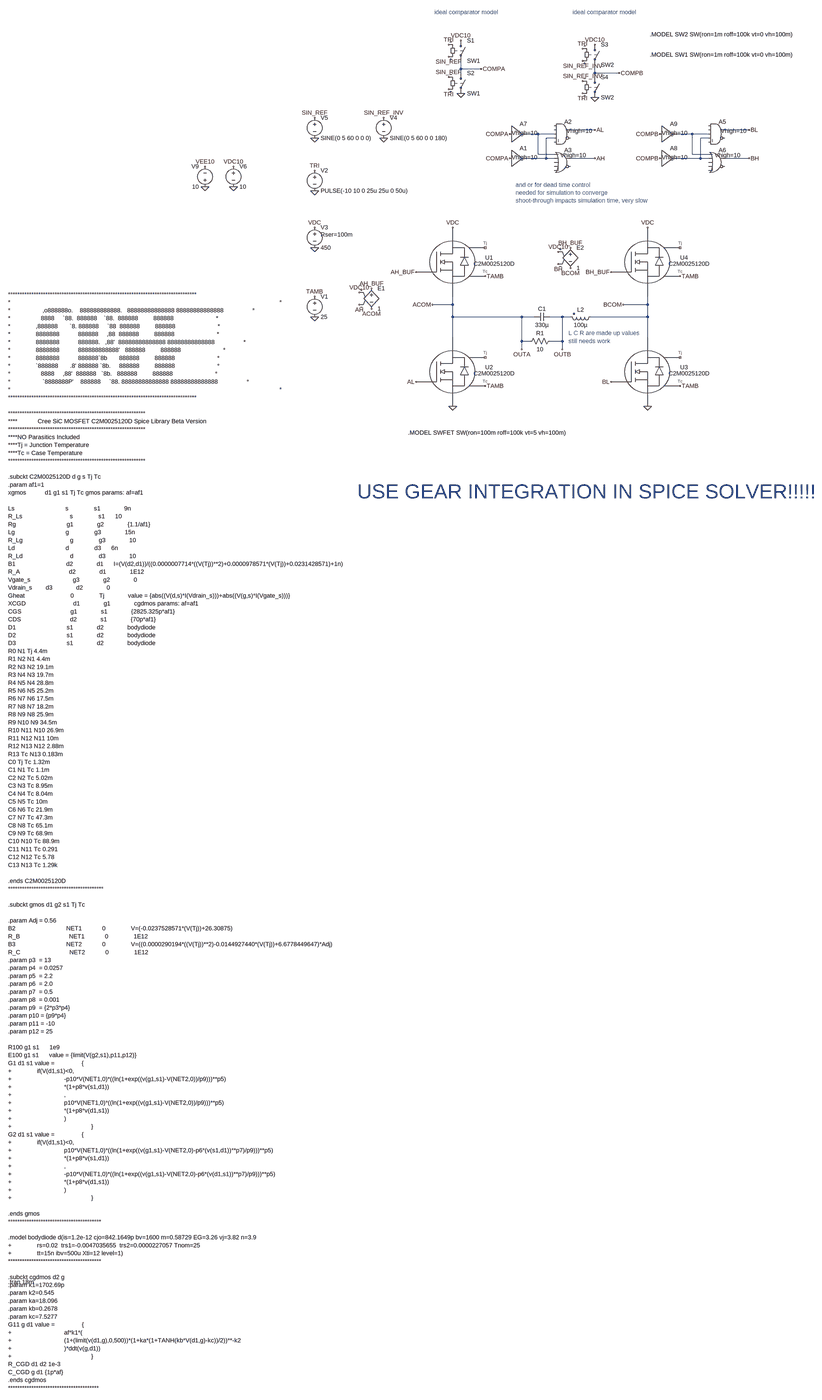
[diagram p0: schematic littlebox.asc, whole sheet]
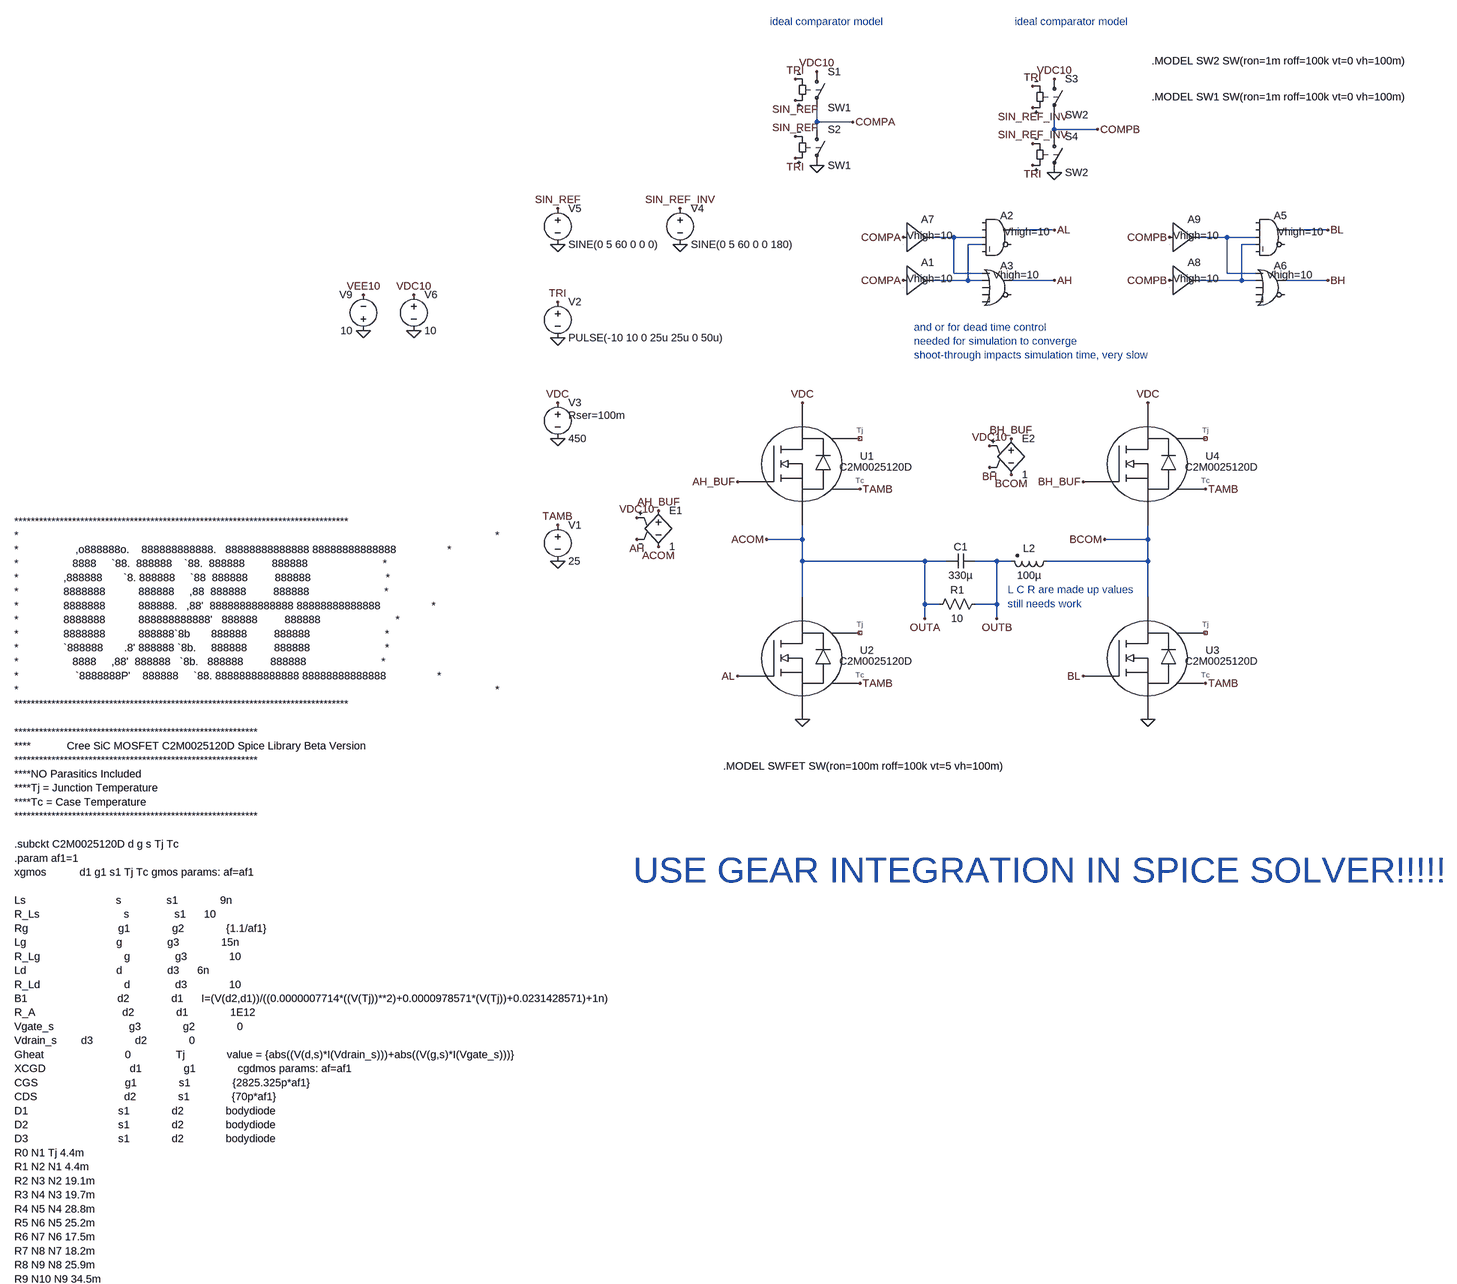
[diagram p1: schematic littlebox.asc, part, row 1 of 2, column 1 of 1]
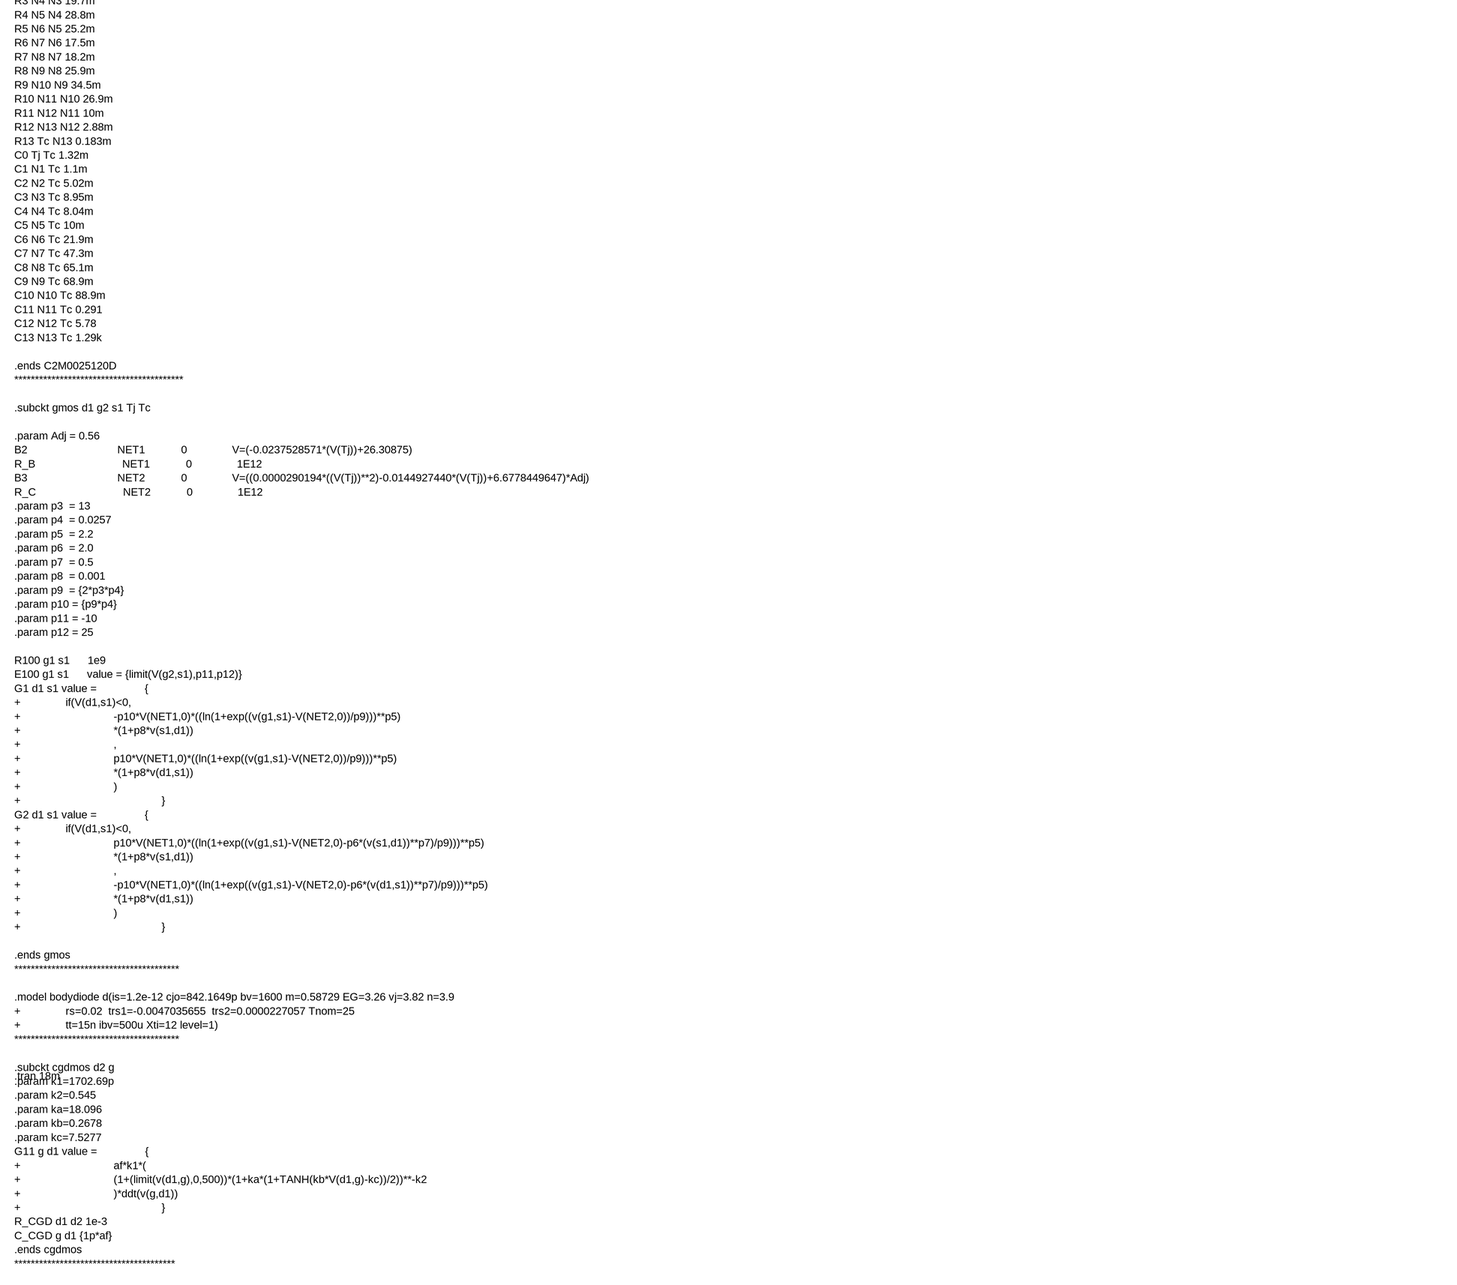
[diagram p2: schematic littlebox.asc, part, row 2 of 2, column 1 of 1]
littlebox.asc, the LTspice schematic file:
Version 4
SHEET 1 1896 3592
WIRE 224 -1200 224 -1232
WIRE 304 -1200 224 -1200
WIRE 224 -1184 224 -1200
WIRE 752 -1184 752 -1216
WIRE 848 -1184 752 -1184
WIRE 752 -1168 752 -1184
WIRE 752 -960 656 -960
WIRE 1360 -960 1264 -960
WIRE 528 -944 480 -944
WIRE 592 -944 528 -944
WIRE 1136 -944 1072 -944
WIRE 1200 -944 1136 -944
WIRE 592 -928 560 -928
WIRE 1200 -928 1168 -928
WIRE 528 -864 528 -944
WIRE 592 -864 528 -864
WIRE 1136 -864 1136 -944
WIRE 1200 -864 1136 -864
WIRE 560 -848 560 -928
WIRE 560 -848 480 -848
WIRE 592 -848 560 -848
WIRE 752 -848 656 -848
WIRE 1168 -848 1168 -928
WIRE 1168 -848 1072 -848
WIRE 1200 -848 1168 -848
WIRE 1360 -848 1264 -848
WIRE 192 -272 192 -304
WIRE 192 -272 112 -272
WIRE 960 -272 960 -304
WIRE 960 -272 864 -272
WIRE 192 -224 192 -272
WIRE 464 -224 192 -224
WIRE 512 -224 464 -224
WIRE 624 -224 576 -224
WIRE 656 -224 624 -224
WIRE 960 -224 960 -272
WIRE 960 -224 736 -224
WIRE 192 -144 192 -224
WIRE 960 -144 960 -224
WIRE 464 -128 464 -224
WIRE 496 -128 464 -128
WIRE 624 -128 624 -224
WIRE 624 -128 576 -128
WIRE 464 -96 464 -128
WIRE 624 -96 624 -128
FLAG -352 -720 0
FLAG -352 -224 0
FLAG -352 -496 0
FLAG 320 -384 TAMB
FLAG 320 48 TAMB
FLAG 1088 -384 TAMB
FLAG 1088 48 TAMB
FLAG 192 128 0
FLAG 960 128 0
FLAG 192 -576 VDC
FLAG 960 -576 VDC
FLAG -352 -576 VDC
FLAG 48 -400 AH_BUF
FLAG 48 32 AL
FLAG 816 -400 BH_BUF
FLAG 816 32 BL
FLAG -352 -304 TAMB
FLAG -352 -928 0
FLAG -80 -928 0
FLAG -80 -1008 SIN_REF_INV
FLAG -352 -1008 SIN_REF
FLAG -352 -800 TRI
FLAG -672 -736 0
FLAG -672 -816 VDC10
FLAG 176 -1248 SIN_REF
FLAG 176 -1296 TRI
FLAG 112 -272 ACOM
FLAG 864 -272 BCOM
FLAG 224 -1312 VDC10
FLAG 752 -1296 VDC10
FLAG -784 -816 VEE10
FLAG -784 -736 0
FLAG 304 -1200 COMPA
FLAG 848 -1184 COMPB
FLAG 224 -1104 0
FLAG 752 -1088 0
FLAG 176 -1120 TRI
FLAG 176 -1168 SIN_REF
FLAG 704 -1104 TRI
FLAG 704 -1152 SIN_REF_INV
FLAG 704 -1280 TRI
FLAG 704 -1232 SIN_REF_INV
FLAG 416 -848 COMPA
FLAG 416 -944 COMPA
FLAG 752 -960 AL
FLAG -176 -320 VDC10
FLAG 752 -848 AH
FLAG -176 -272 AH
FLAG -128 -256 ACOM
FLAG -128 -336 AH_BUF
FLAG 1360 -960 BL
FLAG 1360 -848 BH
FLAG 608 -480 VDC10
FLAG 608 -432 BH
FLAG 656 -416 BCOM
FLAG 656 -496 BH_BUF
FLAG 1008 -848 COMPB
FLAG 1008 -944 COMPB
FLAG 464 -96 OUTA
FLAG 624 -96 OUTB
SYMBOL voltage -352 -320 R0
WINDOW 123 0 0 Left 2
WINDOW 39 0 0 Left 2
SYMATTR InstName V1
SYMATTR Value 25
SYMBOL voltage -352 -816 R0
WINDOW 123 0 0 Left 2
WINDOW 39 0 0 Left 2
SYMATTR InstName V2
SYMATTR Value PULSE(-10 10 0 25u 25u 0 50u)
SYMBOL voltage -352 -592 R0
WINDOW 123 0 0 Left 2
WINDOW 39 24 44 Left 2
SYMATTR SpiceLine Rser=100m
SYMATTR InstName V3
SYMATTR Value 450
SYMBOL voltage -80 -1024 R0
WINDOW 123 0 0 Left 2
WINDOW 39 0 0 Left 2
SYMATTR InstName V4
SYMATTR Value SINE(0 5 60 0 0 180)
SYMBOL voltage -352 -1024 R0
WINDOW 123 0 0 Left 2
WINDOW 39 0 0 Left 2
SYMATTR InstName V5
SYMATTR Value SINE(0 5 60 0 0 0)
SYMBOL voltage -672 -832 R0
WINDOW 123 0 0 Left 2
WINDOW 39 0 0 Left 2
SYMATTR InstName V6
SYMATTR Value 10
SYMBOL voltage -784 -720 R180
WINDOW 0 24 96 Left 2
WINDOW 3 24 16 Left 2
WINDOW 123 0 0 Left 2
WINDOW 39 0 0 Left 2
SYMATTR InstName V9
SYMATTR Value 10
SYMBOL sw 224 -1328 R0
SYMATTR InstName S1
SYMATTR Value SW1
SYMBOL sw 224 -1200 R0
SYMATTR InstName S2
SYMATTR Value SW1
SYMBOL sw 752 -1312 R0
SYMATTR InstName S3
SYMATTR Value SW2
SYMBOL sw 752 -1184 R0
SYMATTR InstName S4
SYMATTR Value SW2
SYMBOL Digital\\buf1 416 -912 R0
WINDOW 3 8 60 Left 2
SYMATTR Value Vhigh=10
SYMATTR InstName A1
SYMATTR Value2 Tau=200n
SYMBOL Digital\\and 624 -1008 R0
WINDOW 3 16 52 Left 2
SYMATTR Value Vhigh=10
SYMATTR InstName A2
SYMATTR Value2 Trise=100n
SYMBOL Digital\\or 624 -896 R0
WINDOW 3 -8 36 Left 2
SYMATTR Value Vhigh=10
SYMATTR InstName A3
SYMATTR Value2 Trise=100n
SYMBOL e -128 -352 R0
SYMATTR InstName E1
SYMATTR Value 1
SYMBOL Digital\\and 1232 -1008 R0
WINDOW 3 16 52 Left 2
SYMATTR Value Vhigh=10
SYMATTR InstName A5
SYMATTR Value2 Trise=100n
SYMBOL Digital\\or 1232 -896 R0
WINDOW 3 -8 36 Left 2
SYMATTR Value Vhigh=10
SYMATTR InstName A6
SYMATTR Value2 Trise=100n
SYMBOL e 656 -512 R0
SYMATTR InstName E2
SYMATTR Value 1
SYMBOL Digital\\buf1 416 -1008 R0
WINDOW 3 8 60 Left 2
SYMATTR Value Vhigh=10
SYMATTR InstName A7
SYMATTR Value2 Tau=100n
SYMBOL Digital\\buf1 1008 -912 R0
WINDOW 3 8 60 Left 2
SYMATTR Value Vhigh=10
SYMATTR InstName A8
SYMATTR Value2 Tau=200n
SYMBOL Digital\\buf1 1008 -1008 R0
WINDOW 3 8 60 Left 2
SYMATTR Value Vhigh=10
SYMATTR InstName A9
SYMATTR Value2 Tau=100n
SYMBOL ind2 752 -240 R90
WINDOW 0 4 56 VBottom 2
WINDOW 3 32 56 VTop 2
SYMATTR InstName L2
SYMATTR Value 100µ
SYMATTR Type ind
SYMBOL cap 576 -240 R90
WINDOW 0 0 32 VBottom 2
WINDOW 3 32 32 VTop 2
SYMATTR InstName C1
SYMATTR Value 330µ
SYMBOL res 592 -144 R90
WINDOW 0 0 56 VBottom 2
WINDOW 3 32 56 VTop 2
SYMATTR InstName R1
SYMATTR Value 10
SYMBOL power_nmos_heat 80 -432 R0
SYMATTR Value C2M0025120D
SYMATTR InstName U1
SYMBOL power_nmos_heat 80 0 R0
SYMATTR Value C2M0025120D
SYMATTR InstName U2
SYMBOL power_nmos_heat 848 0 R0
SYMATTR Value C2M0025120D
SYMATTR InstName U3
SYMBOL power_nmos_heat 848 -432 R0
SYMATTR Value C2M0025120D
SYMATTR InstName U4
TEXT -1560 -312 Left 2 !*********************************************************************************\n*                                                                                                                                                               *\n*                   ,o888888o.    888888888888.   88888888888888 88888888888888                 *\n*                  8888     `88.  888888    `88.  888888         888888                         *\n*               ,888888       `8. 888888     `88  888888         888888                         *\n*               8888888           888888     ,88  888888         888888                         *\n*               8888888           888888.   ,88'  88888888888888 88888888888888                 *\n*               8888888           888888888888'   888888         888888                         *\n*               8888888           888888`8b       888888         888888                         *\n*               `888888       .8' 888888 `8b.     888888         888888                         *\n*                  8888     ,88'  888888   `8b.   888888         888888                         *\n*                   `8888888P'    888888     `88. 88888888888888 88888888888888                 *\n*                                                                                                                                                               *\n*********************************************************************************\n \n***********************************************************\n****            Cree SiC MOSFET C2M0025120D Spice Library Beta Version\n***********************************************************\n****NO Parasitics Included\n****Tj = Junction Temperature\n****Tc = Case Temperature\n***********************************************************\n \n.subckt C2M0025120D d g s Tj Tc\n.param af1=1\nxgmos           d1 g1 s1 Tj Tc gmos params: af=af1\n \nLs                              s               s1              9n\nR_Ls                            s               s1      10\nRg                              g1              g2              {1.1/af1}\nLg                              g               g3              15n\nR_Lg                            g               g3              10\nLd                              d               d3      6n\nR_Ld                            d               d3              10\nB1                              d2              d1      I=(V(d2,d1))/((0.0000007714*((V(Tj))**2)+0.0000978571*(V(Tj))+0.0231428571)+1n)\nR_A                             d2              d1              1E12\nVgate_s                         g3              g2              0\nVdrain_s        d3              d2              0\nGheat                           0               Tj              value = {abs((V(d,s)*I(Vdrain_s)))+abs((V(g,s)*I(Vgate_s)))}\nXCGD                            d1              g1              cgdmos params: af=af1\nCGS                             g1              s1              {2825.325p*af1}\nCDS                             d2              s1              {70p*af1}\nD1                              s1              d2              bodydiode\nD2                              s1              d2              bodydiode\nD3                              s1              d2              bodydiode\nR0 N1 Tj 4.4m\nR1 N2 N1 4.4m\nR2 N3 N2 19.1m\nR3 N4 N3 19.7m\nR4 N5 N4 28.8m\nR5 N6 N5 25.2m\nR6 N7 N6 17.5m\nR7 N8 N7 18.2m\nR8 N9 N8 25.9m\nR9 N10 N9 34.5m\nR10 N11 N10 26.9m\nR11 N12 N11 10m\nR12 N13 N12 2.88m\nR13 Tc N13 0.183m\nC0 Tj Tc 1.32m\nC1 N1 Tc 1.1m\nC2 N2 Tc 5.02m\nC3 N3 Tc 8.95m\nC4 N4 Tc 8.04m\nC5 N5 Tc 10m\nC6 N6 Tc 21.9m\nC7 N7 Tc 47.3m\nC8 N8 Tc 65.1m\nC9 N9 Tc 68.9m\nC10 N10 Tc 88.9m\nC11 N11 Tc 0.291\nC12 N12 Tc 5.78\nC13 N13 Tc 1.29k\n \n.ends C2M0025120D \n*****************************************\n \n.subckt gmos d1 g2 s1 Tj Tc\n \n.param Adj = 0.56\nB2                              NET1            0               V=(-0.0237528571*(V(Tj))+26.30875)\nR_B                             NET1            0               1E12\nB3                              NET2            0               V=((0.0000290194*((V(Tj))**2)-0.0144927440*(V(Tj))+6.6778449647)*Adj)\nR_C                             NET2            0               1E12\n.param p3  = 13\n.param p4  = 0.0257                                                                                                                                                                             \n.param p5  = 2.2\n.param p6  = 2.0\n.param p7  = 0.5\n.param p8  = 0.001\n.param p9  = {2*p3*p4}\n.param p10 = {p9*p4}\n.param p11 = -10\n.param p12 = 25\n \nR100 g1 s1      1e9\nE100 g1 s1      value = {limit(V(g2,s1),p11,p12)} \nG1 d1 s1 value =                {\n+               if(V(d1,s1)<0,\n+                               -p10*V(NET1,0)*((ln(1+exp((v(g1,s1)-V(NET2,0))/p9)))**p5)\n+                               *(1+p8*v(s1,d1))\n+                               ,\n+                               p10*V(NET1,0)*((ln(1+exp((v(g1,s1)-V(NET2,0))/p9)))**p5)\n+                               *(1+p8*v(d1,s1))\n+                               )\n+                                               }\nG2 d1 s1 value =                {\n+               if(V(d1,s1)<0,\n+                               p10*V(NET1,0)*((ln(1+exp((v(g1,s1)-V(NET2,0)-p6*(v(s1,d1))**p7)/p9)))**p5)\n+                               *(1+p8*v(s1,d1))\n+                               ,\n+                               -p10*V(NET1,0)*((ln(1+exp((v(g1,s1)-V(NET2,0)-p6*(v(d1,s1))**p7)/p9)))**p5)\n+                               *(1+p8*v(d1,s1))\n+                               )\n+                                               }\n \n.ends gmos\n****************************************\n \n.model bodydiode d(is=1.2e-12 cjo=842.1649p bv=1600 m=0.58729 EG=3.26 vj=3.82 n=3.9 \n+               rs=0.02  trs1=-0.0047035655  trs2=0.0000227057 Tnom=25\n+               tt=15n ibv=500u Xti=12 level=1)\n****************************************\n \n.subckt cgdmos d2 g\n.param k1=1702.69p\n.param k2=0.545\n.param ka=18.096\n.param kb=0.2678\n.param kc=7.5277\nG11 g d1 value =                {\n+                               af*k1*(\n+                               (1+(limit(v(d1,g),0,500))*(1+ka*(1+TANH(kb*V(d1,g)-kc))/2))**-k2\n+                               )*ddt(v(g,d1))\n+                                               }\nR_CGD d1 d2 1e-3\nC_CGD g d1 {1p*af}\n.ends cgdmos\n***************************************
TEXT -1560 3576 Left 2 !.tran 18m
TEXT 968 -1256 Left 2 !.MODEL SW1 SW(ron=1m roff=100k vt=0 vh=100m)
TEXT 968 -1336 Left 2 !.MODEL SW2 SW(ron=1m roff=100k vt=0 vh=100m)
TEXT 440 -744 Left 2 ;and or for dead time control\nneeded for simulation to converge\nshoot-through impacts simulation time, very slow
TEXT 120 -1424 Left 2 ;ideal comparator model
TEXT 664 -1424 Left 2 ;ideal comparator model
TEXT 16 232 Left 2 !.MODEL SWFET SW(ron=100m roff=100k vt=5 vh=100m)
TEXT 648 -160 Left 2 ;L C R are made up values\nstill needs work
TEXT -184 464 Left 6 ;USE GEAR INTEGRATION IN SPICE SOLVER!!!!!

The netlist it stands for:
* littlebox.asc
V1 TAMB 0 25
V2 TRI 0 PULSE(-10 10 0 25u 25u 0 50u)
V3 VDC 0 450 Rser=100m
V4 SIN_REF_INV 0 SINE(0 5 60 0 0 180)
V5 SIN_REF 0 SINE(0 5 60 0 0 0)
V6 VDC10 0 10
V9 0 VEE10 10
S1 VDC10 COMPA SIN_REF TRI SW1
S2 COMPA 0 TRI SIN_REF SW1
S3 VDC10 COMPB SIN_REF_INV TRI SW2
S4 COMPB 0 TRI SIN_REF_INV SW2
A1 COMPA 0 0 0 0 0 N003 0 BUF Vhigh=10 Tau=200n
A2 0 0 N001 N003 0 0 AL 0 AND Vhigh=10 Trise=100n
A3 N001 N003 0 0 0 0 AH 0 OR Vhigh=10 Trise=100n
E1 AH_BUF OUTA VDC10 AH 1
A5 0 0 N002 N004 0 0 BL 0 AND Vhigh=10 Trise=100n
A6 N002 N004 0 0 0 0 BH 0 OR Vhigh=10 Trise=100n
E2 BH_BUF BCOM VDC10 BH 1
A7 COMPA 0 0 0 0 0 N001 0 BUF Vhigh=10 Tau=100n
A8 COMPB 0 0 0 0 0 N004 0 BUF Vhigh=10 Tau=200n
A9 COMPB 0 0 0 0 0 N002 0 BUF Vhigh=10 Tau=100n
L2 BCOM OUTB 100µ
C1 OUTB OUTA 330µ
R1 OUTB OUTA 10
XU1 VDC AH_BUF OUTA NC_01 TAMB C2M0025120D  ; pins Drain Gate Source Tj Tc
XU2 OUTA AL 0 NC_02 TAMB C2M0025120D  ; pins Drain Gate Source Tj Tc
XU3 BCOM BL 0 NC_03 TAMB C2M0025120D  ; pins Drain Gate Source Tj Tc
XU4 VDC BH_BUF BCOM NC_04 TAMB C2M0025120D  ; pins Drain Gate Source Tj Tc
*********************************************************************************
*                                                                                                                                                               *
*                   ,o888888o.    888888888888.   88888888888888 88888888888888                 *
*                  8888     `88.  888888    `88.  888888         888888                         *
*               ,888888       `8. 888888     `88  888888         888888                         *
*               8888888           888888     ,88  888888         888888                         *
*               8888888           888888.   ,88'  88888888888888 88888888888888                 *
*               8888888           888888888888'   888888         888888                         *
*               8888888           888888`8b       888888         888888                         *
*               `888888       .8' 888888 `8b.     888888         888888                         *
*                  8888     ,88'  888888   `8b.   888888         888888                         *
*                   `8888888P'    888888     `88. 88888888888888 88888888888888                 *
*                                                                                                                                                               *
*********************************************************************************
***********************************************************
****            Cree SiC MOSFET C2M0025120D Spice Library Beta Version
***********************************************************
****NO Parasitics Included
****Tj = Junction Temperature
****Tc = Case Temperature
***********************************************************
.subckt C2M0025120D d g s Tj Tc
.param af1=1
xgmos           d1 g1 s1 Tj Tc gmos params: af=af1
Ls                              s               s1              9n
R_Ls                            s               s1      10
Rg                              g1              g2              {1.1/af1}
Lg                              g               g3              15n
R_Lg                            g               g3              10
Ld                              d               d3      6n
R_Ld                            d               d3              10
B1                              d2              d1      I=(V(d2,d1))/((0.0000007714*((V(Tj))**2)+0.0000978571*(V(Tj))+0.0231428571)+1n)
R_A                             d2              d1              1E12
Vgate_s                         g3              g2              0
Vdrain_s        d3              d2              0
Gheat                           0               Tj              value = {abs((V(d,s)*I(Vdrain_s)))+abs((V(g,s)*I(Vgate_s)))}
XCGD                            d1              g1              cgdmos params: af=af1
CGS                             g1              s1              {2825.325p*af1}
CDS                             d2              s1              {70p*af1}
D1                              s1              d2              bodydiode
D2                              s1              d2              bodydiode
D3                              s1              d2              bodydiode
R0 N1 Tj 4.4m
R1 N2 N1 4.4m
R2 N3 N2 19.1m
R3 N4 N3 19.7m
R4 N5 N4 28.8m
R5 N6 N5 25.2m
R6 N7 N6 17.5m
R7 N8 N7 18.2m
R8 N9 N8 25.9m
R9 N10 N9 34.5m
R10 N11 N10 26.9m
R11 N12 N11 10m
R12 N13 N12 2.88m
R13 Tc N13 0.183m
C0 Tj Tc 1.32m
C1 N1 Tc 1.1m
C2 N2 Tc 5.02m
C3 N3 Tc 8.95m
C4 N4 Tc 8.04m
C5 N5 Tc 10m
C6 N6 Tc 21.9m
C7 N7 Tc 47.3m
C8 N8 Tc 65.1m
C9 N9 Tc 68.9m
C10 N10 Tc 88.9m
C11 N11 Tc 0.291
C12 N12 Tc 5.78
C13 N13 Tc 1.29k
.ends C2M0025120D
*****************************************
.subckt gmos d1 g2 s1 Tj Tc
.param Adj = 0.56
B2                              NET1            0               V=(-0.0237528571*(V(Tj))+26.30875)
R_B                             NET1            0               1E12
B3                              NET2            0               V=((0.0000290194*((V(Tj))**2)-0.0144927440*(V(Tj))+6.6778449647)*Adj)
R_C                             NET2            0               1E12
.param p3  = 13
.param p4  = 0.0257
.param p5  = 2.2
.param p6  = 2.0
.param p7  = 0.5
.param p8  = 0.001
.param p9  = {2*p3*p4}
.param p10 = {p9*p4}
.param p11 = -10
.param p12 = 25
R100 g1 s1      1e9
E100 g1 s1      value = {limit(V(g2,s1),p11,p12)}
G1 d1 s1 value =                {
+               if(V(d1,s1)<0,
+                               -p10*V(NET1,0)*((ln(1+exp((v(g1,s1)-V(NET2,0))/p9)))**p5)
+                               *(1+p8*v(s1,d1))
+                               ,
+                               p10*V(NET1,0)*((ln(1+exp((v(g1,s1)-V(NET2,0))/p9)))**p5)
+                               *(1+p8*v(d1,s1))
+                               )
+                                               }
G2 d1 s1 value =                {
+               if(V(d1,s1)<0,
+                               p10*V(NET1,0)*((ln(1+exp((v(g1,s1)-V(NET2,0)-p6*(v(s1,d1))**p7)/p9)))**p5)
+                               *(1+p8*v(s1,d1))
+                               ,
+                               -p10*V(NET1,0)*((ln(1+exp((v(g1,s1)-V(NET2,0)-p6*(v(d1,s1))**p7)/p9)))**p5)
+                               *(1+p8*v(d1,s1))
+                               )
+                                               }
.ends gmos
****************************************
.model bodydiode d(is=1.2e-12 cjo=842.1649p bv=1600 m=0.58729 EG=3.26 vj=3.82 n=3.9
+               rs=0.02  trs1=-0.0047035655  trs2=0.0000227057 Tnom=25
+               tt=15n ibv=500u Xti=12 level=1)
****************************************
.subckt cgdmos d2 g
.param k1=1702.69p
.param k2=0.545
.param ka=18.096
.param kb=0.2678
.param kc=7.5277
G11 g d1 value =                {
+                               af*k1*(
+                               (1+(limit(v(d1,g),0,500))*(1+ka*(1+TANH(kb*V(d1,g)-kc))/2))**-k2
+                               )*ddt(v(g,d1))
+                                               }
R_CGD d1 d2 1e-3
C_CGD g d1 {1p*af}
.ends cgdmos
***************************************
.tran 18m
.MODEL SW1 SW(ron=1m roff=100k vt=0 vh=100m)
.MODEL SW2 SW(ron=1m roff=100k vt=0 vh=100m)
* and or for dead time control
* needed for simulation to converge
* shoot-through impacts simulation time, very slow
* ideal comparator model
* ideal comparator model
.MODEL SWFET SW(ron=100m roff=100k vt=5 vh=100m)
* L C R are made up values
* still needs work
* USE GEAR INTEGRATION IN SPICE SOLVER!!!!!
.backanno
.end